# EasyEDA Pro project boost_converter.eprj

# Schematic Schematic1
Create Date: 2025-03-18; Page Name: P1; Project Name: boost_converter; Schematic Name: Schematic1; Update Date: 2025-04-02; Company: EasyEDA.com; Page Size: A4; Version: V1.0
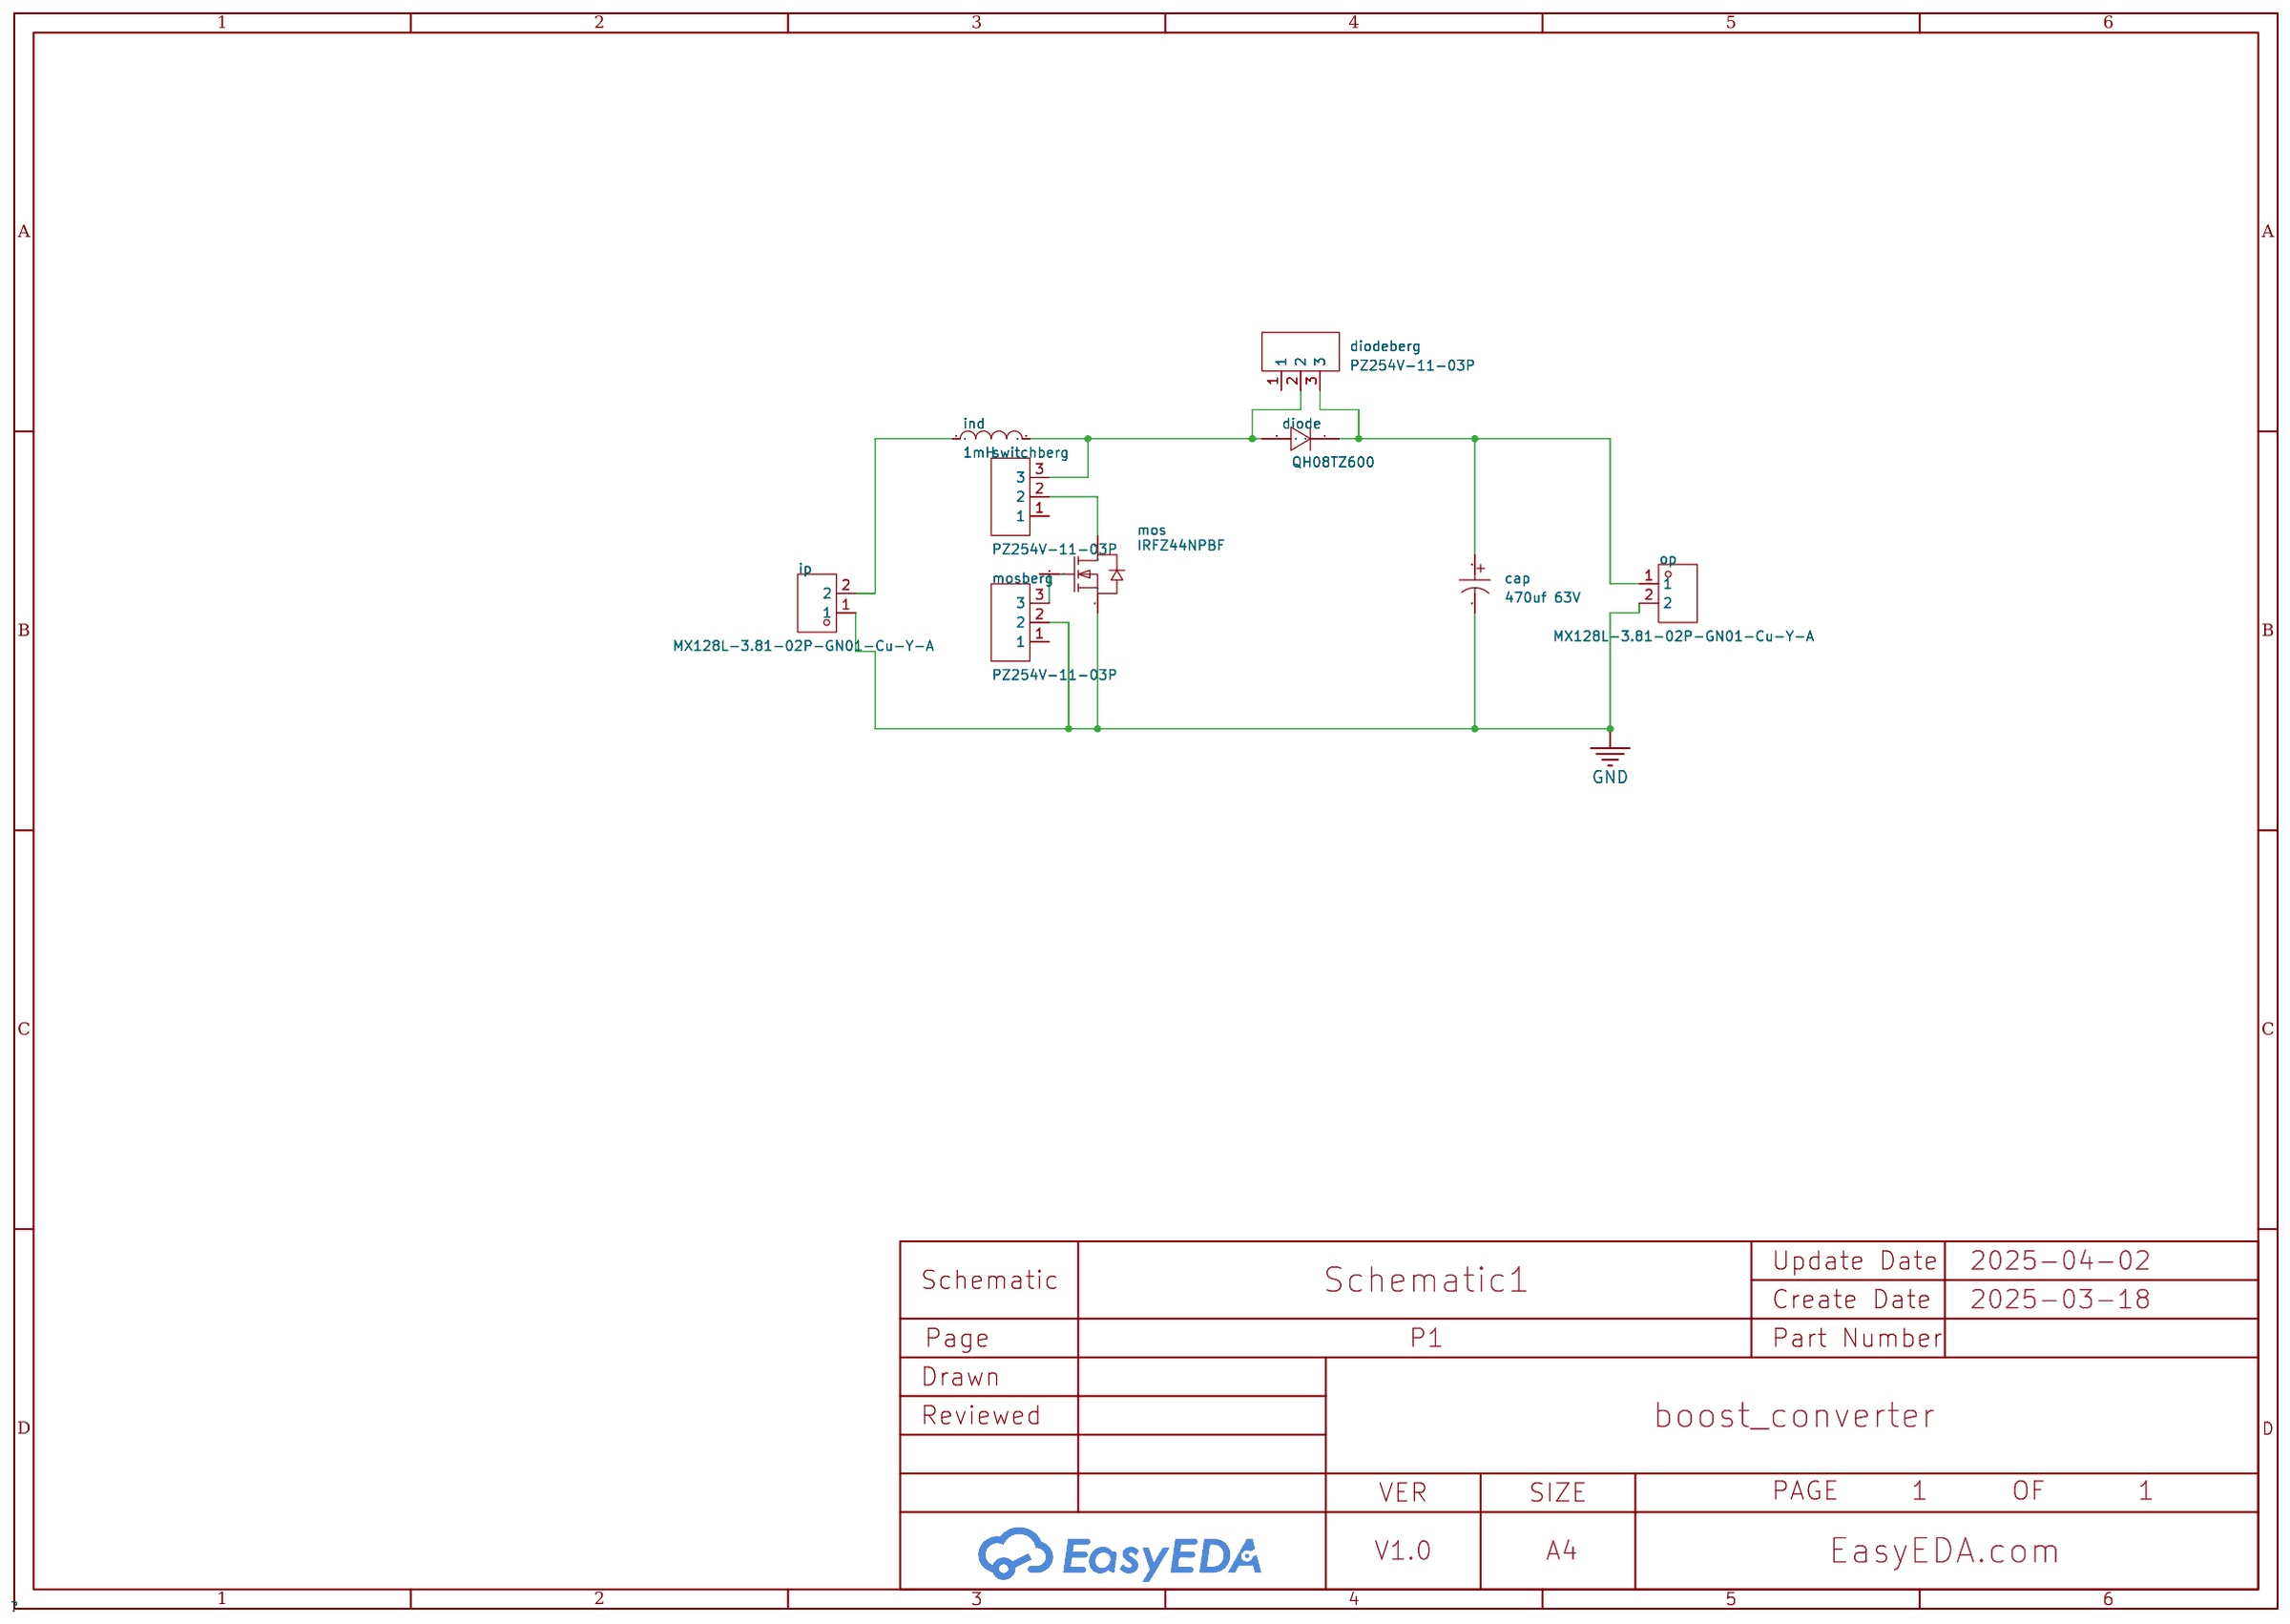
[diagram p0: schematic sheet]

## Parts
cap  470uf 63V  [CAP-TH_BD12.5-P5.00-D0.6-FD]
diode  QH08TZ600  [TO-220AC_L10.0-W4.5-P5.08-L]
diodeberg  PZ254V-11-03P  [HDR-TH_3P-P2.54-V-M]
ind  1mH  [IND-TH_BD32.5-P29.0-D0.7_2324-H-RC]
ip  MX128L-3.81-02P-GN01-Cu-Y-A  [CONN-TH_2P-P3.81_MX128L-3.81-GN01-02P-CU-Y-A]
mos  IRFZ44NPBF  [TO-220-3_L10.0-W4.5-P2.54-L]
mosberg  PZ254V-11-03P  [HDR-TH_3P-P2.54-V-M]
op  MX128L-3.81-02P-GN01-Cu-Y-A  [CONN-TH_2P-P3.81_MX128L-3.81-GN01-02P-CU-Y-A]
switchberg  PZ254V-11-03P  [HDR-TH_3P-P2.54-V-M]

## Library data of the parts
cap = 470uf 63V: Supplier Part: C9900010211; Supplier Footprint: 直径12.5 高度20 5mm 脚距5MM; JLCPCB Part Class: Extended Part; Supplier: LCSC
diode = QH08TZ600: Forward Voltage (Vf@If):3.15V@8A Reverse Voltage (Vr):600V Average Rectified Current (Io): Reverse Leakage Current:250uA@600V Reverse Recovery Time (trr):11.1ns Operating Temperature:- Operating Temperature:-; LCSC Part Name: 电压:600V 电流:8A; Supplier Part: C568356; Manufacturer: Power Integrations(帕沃英蒂格盛); Supplier Footprint: TO-220AC; JLCPCB Part Class: Extended Part; Supplier: LCSC; Forward Voltage (Vf@If): 3.15V@8A; Reverse Voltage (Vr): 600V; Reverse Leakage Current: 250uA@600V; Reverse Recovery Time (trr): 11.1ns
diodeberg mosberg switchberg = PZ254V-11-03P: Pin Structure:1x3P Pitch:2.54mm Row Spacing:- Circluar Pins/Square Pins:Policy Mounting Type:Straight Number of Rows:Single Row Number of Pins:3P Current Rating:3A Voltage Rating (Max):250V Length of Mating Pin:6mm Insulation Height:2.5mm Length of End Co; LCSC Part Name: 1x3P 间距:2.54mm 方针 直插; Supplier Part: C2937625; Manufacturer: XFCN(兴飞); Supplier Footprint: 插件,P=2.54mm; JLCPCB Part Class: Extended Part; Datasheet: https://atta.szlcsc.com/upload/public/pdf/source/20200309/C492402_8335C3D49C4E4C618838D59BB1D024C1.pdf; Supplier: LCSC; Pin Structure: 1x3P; Pitch: 2.54mm; Circluar Pins/Square Pins: Policy; Mounting Type: Straight; Number of Rows: Single Row; Number of Pins: 3P; Current Rating: 3A; Voltage Rating (Max): 250V; Length of Mating Pin: 6mm; Insulation Height: 2.5mm; Length of End Connection Pin: 3mm; Operating Temperature: -40℃~+105℃; Color: Black
ind = 2324-H-RC: Inductance:1mH Tolerance:±15% Tolerance:±15% Rated Current: Saturation Current (Isat):- DC Resistance (DCR): Ratings:-; LCSC Part Name: 1mH ±15%; Supplier Part: C3350085; Manufacturer: BOURNS; Supplier Footprint: 插件,D=32.5mm; JLCPCB Part Class: Extended Part; Datasheet: https://atta.szlcsc.com/upload/public/pdf/source/20210429/1F2405F82C027895AAC6981C0E6D0906.pdf; Supplier: LCSC; Tolerance: ±15%
ip op = MX128L-3.81-02P-GN01-Cu-Y-A: Structure:1x2P Pitch:3.81mm Color:Green Mounting Style:Direct Insert Number of Pins:2P Number of Rows:1 Number of PINs Per Row:2 Screw Specification:M2 Current Rating (Max):10A Voltage Rating (Max):150V Wire Gauge - AWG:16~26 Wire Gauge - AWG:16~26 Wire G; LCSC Part Name: 1x2P 3.81mm 直插 排数:1 每排P数:2; Supplier Part: C5188452; Manufacturer: MAX(迈旭); Supplier Footprint: 插件,P=3.81mm; JLCPCB Part Class: Extended Part; Datasheet: https://atta.szlcsc.com/upload/public/pdf/source/20230914/B6D11694B2EF123065C24316748628EB.pdf; Supplier: LCSC; Structure: 1x2P; Pitch: 3.81mm; Color: Green; Mounting Style: Direct Insert; Number of Pins: 2P; Number of Rows: 1; Number of PINs Per Row: 2; Screw Specification: M2; Current Rating (Max): 10A; Voltage Rating (Max): 150V; Wire Gauge - AWG: 16~26; Wire Gauge - mm2: 1.5; Operating Temperature Range: -40℃~+105℃
mos = IRFZ44NPBF_C2586: Type:1 N-Channel Drain Source Voltage (Vdss): Continuous Drain Current (Id): Drain Source On Resistance (RDS(on)@Vgs,Id):17.5mΩ@10V,25A Power Dissipation (Pd): Gate Threshold Voltage (Vgs(th)@Id):4V@250uA Total Gate Charge (Qg@Vgs):63nC Input Capacitance; LCSC Part Name: 1个N沟道 耐压:55V 电流:49A; Supplier Part: C2586; Manufacturer: Infineon(英飞凌); Supplier Footprint: TO-220-3; JLCPCB Part Class: Extended Part; Datasheet: https://atta.szlcsc.com/upload/public/pdf/source/20120403/1457706463862.pdf; Supplier: LCSC; Type: 1 N-Channel; Drain Source On Resistance (RDS(on)@Vgs,Id): 17.5mΩ@10V,25A; Gate Threshold Voltage (Vgs(th)@Id): 4V@250uA; Total Gate Charge (Qg@Vgs): 63nC; Input Capacitance (Ciss@Vds): 1.47nF; Reverse Transfer Capacitance (Crss@Vds): 88pF; Operating Temperature: -55℃~+175℃

## Nets
GND: cap.2 ip.1 mos.3(S) mosberg.2 op.2
$1N2002: ind.1 ip.2
$1N2332: mos.1(G) mosberg.3
$1N3338: mos.2(D) switchberg.2
$1N3342: cap.1 diode.1(K) diodeberg.3 op.1
$1N3361: diode.2(A) diodeberg.2 ind.2 switchberg.3

Not connected (* = marked no-connect by the designer): diodeberg 1; mosberg 1; switchberg 1

# Board PCB6
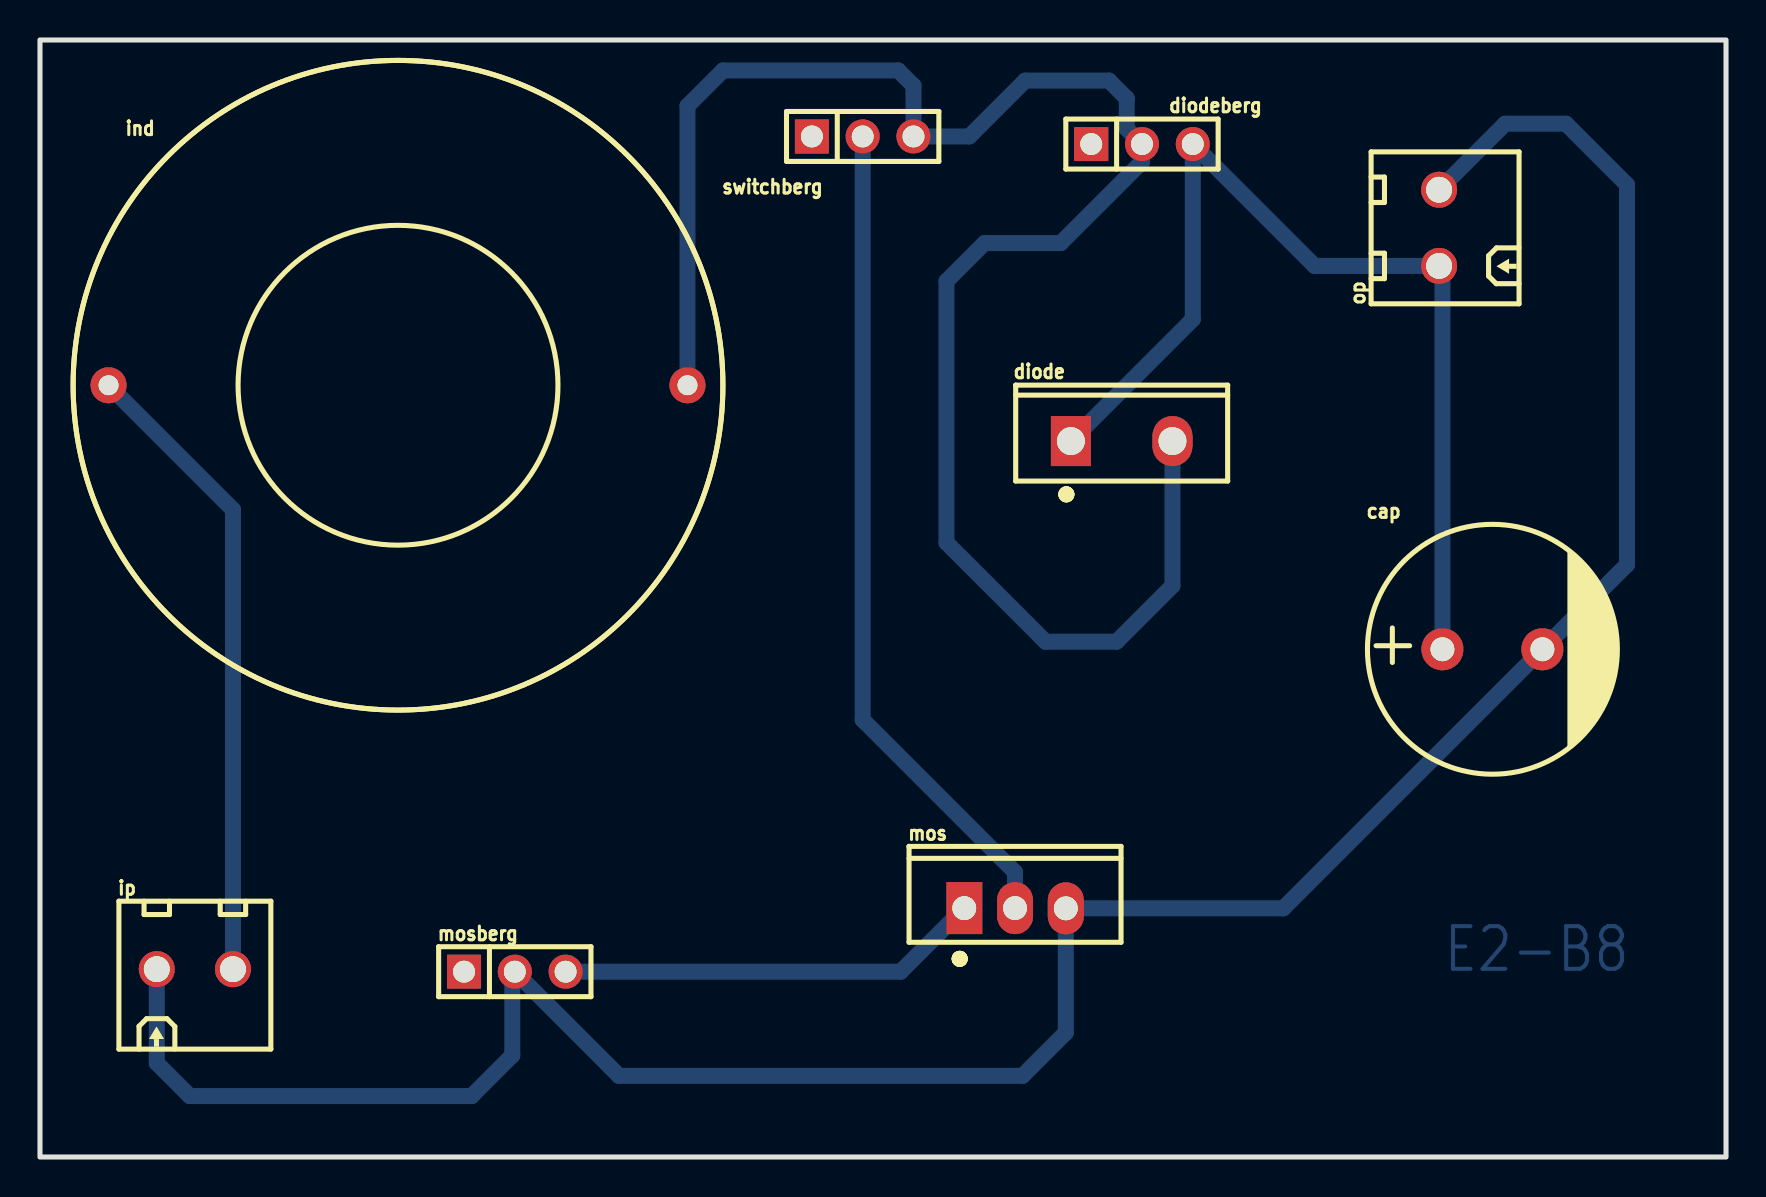
[diagram p1: board, top side]
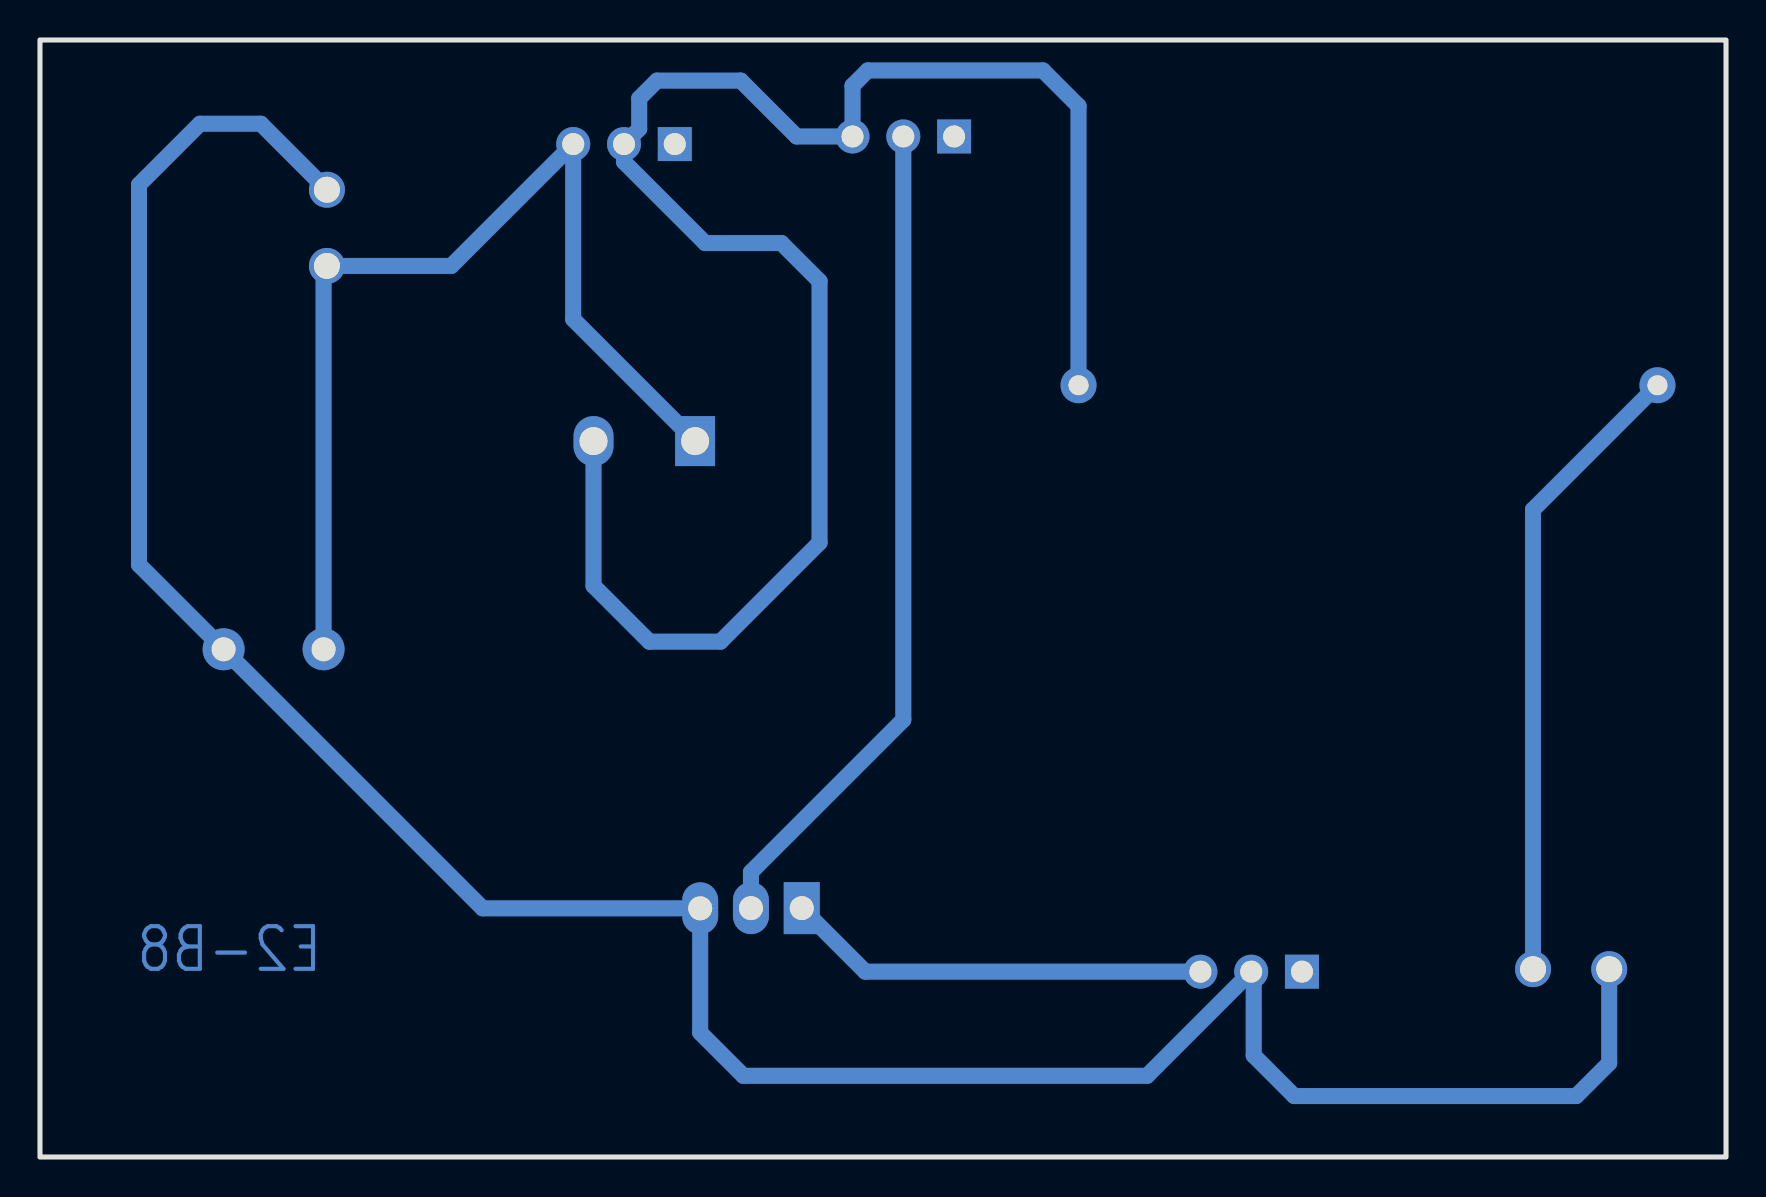
[diagram p2: board, bottom side, seen from below]

Outline 84.33 x 55.88 mm; copper layers: Top Layer, Bottom Layer. Coordinates in mm from the lower left corner of the outline.
Outline path: rectangle 0,55.88 84.33,0
Stack: Top Layer 0.035mm / Dielectric1 1.51mm FR4 er 4.5 / Bottom Layer 0.035mm

## Design rules (mm)
template: JLCPCB Capability(Two Layers Board)
spacing copperThickness1oz (default): track to track 0.102, other pairs 0.152 to 0.3
spacing copperThickness2oz: track to track 0.203, other pairs 0.152 to 0.3
track width copperThickness1oz (default): min 0.127, default 0.254, max 2.54
track width copperThickness2oz: min 0.203, default 0.254, max 2.54
differential pair differentialPair (default): width min 0.127, default 0.254, max 2.54; gap min 0.152, default 0.152
via viaSize (default): diameter min 0.5, default 0.61, max 10; hole min 0.3, default 0.305, max 6.3

## Placement (name value [footprint] x y rotation side)
cap  470uf 63V  [CAP-TH_BD12.5-P5.00-D0.6-FD]  72.64 25.4 0 top
diode  QH08TZ600  [TO-220AC_L10.0-W4.5-P5.08-L]  54.1 35.81 0 top
diodeberg  PZ254V-11-03P  [HDR-TH_3P-P2.54-V-M]  55.12 50.67 0 top
ind  1mH  [IND-TH_BD32.5-P29.0-D0.7_2324-H-RC]  17.91 38.61 0 top
ip  MX128L-3.81-02P-GN01-Cu-Y-A  [CONN-TH_2P-P3.81_MX128L-3.81-GN01-02P-CU-Y-A]  7.75 9.4 0 top
mos  IRFZ44NPBF  [TO-220-3_L10.0-W4.5-P2.54-L]  48.77 12.45 0 top
mosberg  PZ254V-11-03P  [HDR-TH_3P-P2.54-V-M]  23.75 9.27 0 top
NOREF  -  [Pad_e110]  32.39 38.61 0 top
op  MX128L-3.81-02P-GN01-Cu-Y-A  [CONN-TH_2P-P3.81_MX128L-3.81-GN01-02P-CU-Y-A]  69.98 46.48 90 top
switchberg  PZ254V-11-03P  [HDR-TH_3P-P2.54-V-M]  41.15 51.05 0 top

## Footprints (pads in the part's own frame, mm; a bottom-side part is the same pattern mirrored in y, then rotated)
CAP-TH_BD12.5-P5.00-D0.6-FD
  round 2.1 hole 1.2: 1(-2.5,0) 2(2.5,0)
CONN-TH_2P-P3.81_MX128L-3.81-GN01-02P-CU-Y-A
  round 1.8 hole 1.3: 1(-1.905,0) 2(1.905,0)
HDR-TH_3P-P2.54-V-M
  rect 1.7x1.7 hole 1.1: 1(-2.54,0)
  round 1.7 hole 1.1: 2(0,0) 3(2.54,0)
IND-TH_BD32.5-P29.0-D0.7_2324-H-RC
  round 1.8 hole 1: 1(-14.478,0) 2(14.478,0)
Pad_e110
  round 1.524 hole 0.914: 4(0,0)
TO-220-3_L10.0-W4.5-P2.54-L
  rect 1.8x2.6 hole 1.2: 1(-2.54,0.005)
  oval 1.8x2.6 hole 1.2: 2(0,0.005) 3(2.54,-0.005)
TO-220AC_L10.0-W4.5-P5.08-L
  rect 2x2.5 hole 1.4: 1(-2.54,0)
  oval 2x2.5 hole 1.4: 2(2.54,0)

## Nets
As in the schematic, except:
$1N3361: diode.2 diodeberg.2 ind.2 NOREF.4 switchberg.3

Pads without a net: diodeberg 1; mosberg 1; switchberg 1

## Routing (per net, layer and track width the routed paths; a pad name or vN(x,y) marks a point on that pad's centre or on a via; arc(x,y) is an arc through that point)
GND: length 131.3
  Bottom Layer w0.8: ip.1 5.84,4.7 7.49,3.05 21.59,3.05 23.62,5.08 23.62,9.14 mosberg.2 28.96,4.06 49.15,4.06 51.31,6.22 mos.3 62.18,12.44 cap.2 79.37,29.63 79.37,48.64 76.33,51.69 73.28,51.69 op.2
$1N2002: length 31.8
  Bottom Layer w0.8: ind.1 9.65,32.38 ip.2
$1N2332: length 21.3
  Bottom Layer w0.8: mos.1 43.05,9.27 mosberg.3
$1N3338: length 41.8
  Bottom Layer w0.8: switchberg.2 41.15,21.87 48.77,14.25 mos.2
$1N3342: length 51.5
  Bottom Layer w0.8: diode.1 57.66,41.91 diodeberg.3 63.75,44.58 op.1 70.14,44.41 cap.1
$1N3361: length 91.6
  Bottom Layer w0.8: ind.2 32.39,52.58 34.16,54.36 42.93,54.36 43.69,53.59 switchberg.3 46.48,51.05 49.28,53.85 53.47,53.85 54.36,52.96 54.36,51.43 diodeberg.2 55.12,49.78 51.05,45.72 47.24,45.72 45.34,43.81 45.34,30.73 50.29,25.78 53.85,25.78 56.64,28.57 diode.2

## Text on the board
Bottom Layer: E2-B8
